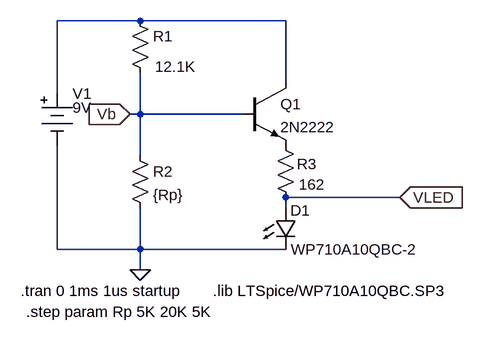
[diagram p0: schematic Photosensor.asc]
Photosensor.asc, the LTspice schematic file:
Version 4
SHEET 1 936 680
WIRE -208 16 -336 16
WIRE 16 16 -208 16
WIRE 16 112 16 16
WIRE -336 128 -336 16
WIRE -208 160 -208 96
WIRE -208 160 -224 160
WIRE -48 160 -208 160
WIRE -208 224 -208 160
WIRE 192 288 16 288
WIRE 16 304 16 288
WIRE -336 368 -336 208
WIRE -208 368 -208 304
WIRE -208 368 -336 368
WIRE 16 368 -208 368
WIRE -208 400 -208 368
FLAG -208 400 0
FLAG -224 160 Vb
IOPIN -224 160 In
FLAG 192 288 VLED
IOPIN 192 288 In
SYMBOL battery -336 112 R0
WINDOW 123 0 0 Left 2
WINDOW 3 24 38 Left 2
SYMATTR InstName V1
SYMATTR Value 9V
SYMBOL res -224 0 R0
WINDOW 3 39 87 Left 2
SYMATTR InstName R1
SYMATTR Value 12.1K
SYMBOL res -224 208 R0
SYMATTR InstName R2
SYMATTR Value {Rp}
SYMBOL res 0 192 R0
WINDOW 0 33 45 Left 2
SYMATTR InstName R3
SYMATTR Value 162
SYMBOL npn -48 112 R0
SYMATTR InstName Q1
SYMATTR Value 2N2222
SYMBOL LED 0 304 R0
WINDOW 0 39 -11 Top 2
SYMATTR InstName D1
SYMATTR Value WP710A10QBC-2
TEXT -96 432 Left 2 !.lib LTSpice/WP710A10QBC.SP3
TEXT -392 432 Left 2 !.tran 0 1ms 1us startup
TEXT -384 464 Left 2 !.step param Rp 5K 20K 5K

The netlist it stands for:
* Photosensor.asc
V1 N001 0 9V
R1 N001 Vb 12.1K
R2 Vb 0 {Rp}
R3 P001 VLED 162
Q1 N001 Vb P001 0 2N2222
D1 VLED 0 WP710A10QBC-2
.model D D
.lib standard.dio
.model NPN NPN
.model PNP PNP
.lib standard.bjt
.lib LTSpice/WP710A10QBC.SP3
.tran 0 1ms 1us startup
.step param Rp 5K 20K 5K
.backanno
.end

* Results of the author's LTspice run, read from the files saved beside the schematic
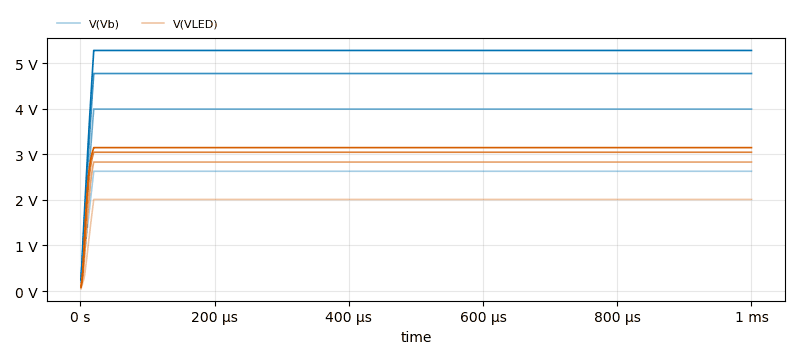
[diagram p1: Transient Analysis of Photosensor.asc, plotted from the saved traces]
* Transient Analysis, 7 runs:
*   V(Vb) [run 1]: min 132.1 mV, max 2.632 V, average 2.606 V, rms 2.613 V, last 2.63 V
*   V(Vb) [run 2]: 195.3 mV at time=1 µs, 195.3 mV at time=1 µs, min 195.3 mV, max 195.3 mV
*   V(Vb) [run 3]: min 195.3 mV, max 3.997 V, average 3.959 V, rms 3.97 V, last 3.995 V
*   V(Vb) [run 4]: 231.6 mV at time=1 µs, 231.6 mV at time=1 µs, min 231.6 mV, max 231.6 mV
*   V(Vb) [run 5]: min 231.6 mV, max 4.778 V, average 4.734 V, rms 4.747 V, last 4.775 V
*   V(Vb) [run 6]: 255 mV at time=1 µs, 255 mV at time=1 µs, min 255 mV, max 255 mV
*   V(Vb) [run 7]: min 255 mV, max 5.284 V, average 5.236 V, rms 5.25 V, last 5.282 V
*   V(VLED) [run 1]: min 49.32 mV, max 2.012 V, average 1.99 V, rms 1.998 V, last 2.011 V
*   V(VLED) [run 2]: 73.02 mV at time=1 µs, 73.02 mV at time=1 µs, min 73.02 mV, max 73.02 mV
*   V(VLED) [run 3]: min 73.02 mV, max 2.832 V, average 2.806 V, rms 2.815 V, last 2.832 V
*   V(VLED) [run 4]: 86.7 mV at time=1 µs, 86.7 mV at time=1 µs, min 86.7 mV, max 86.7 mV
*   V(VLED) [run 5]: min 86.7 mV, max 3.048 V, average 3.023 V, rms 3.031 V, last 3.047 V
*   V(VLED) [run 6]: 95.55 mV at time=1 µs, 95.55 mV at time=1 µs, min 95.55 mV, max 95.55 mV
*   V(VLED) [run 7]: min 95.55 mV, max 3.149 V, average 3.126 V, rms 3.133 V, last 3.149 V